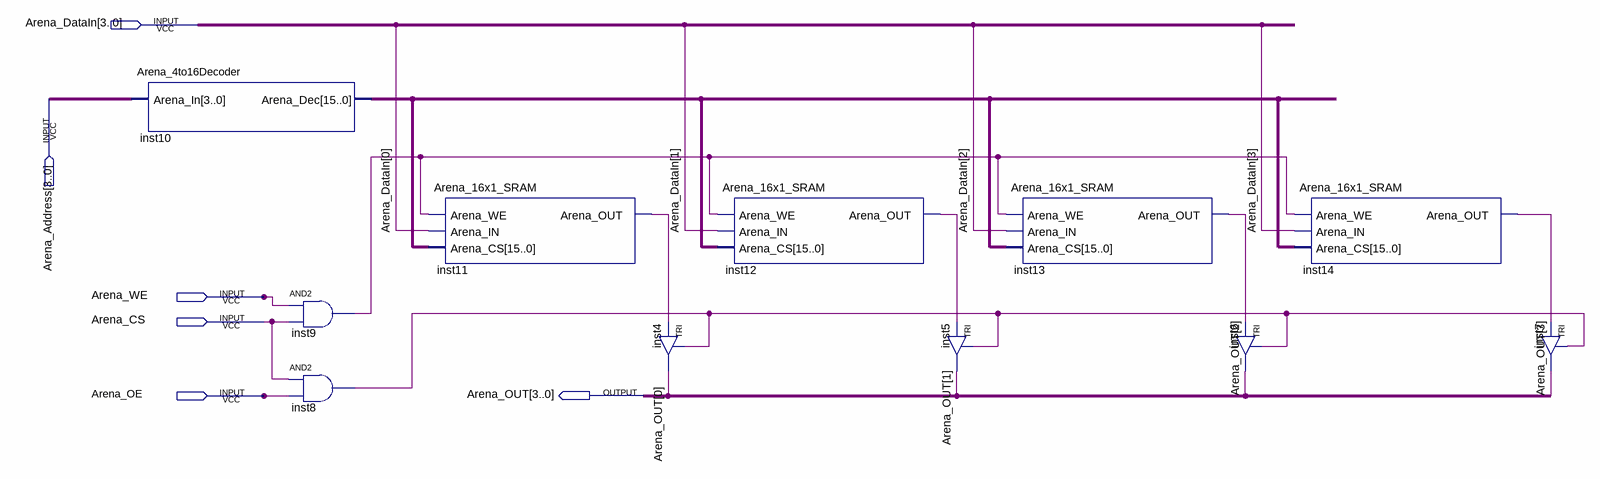
[diagram p0: schematic sheet]
// Quartus schematic Arena_16x4_SRAM.bdf as structural Verilog: 11 symbols, 6 pins
module Arena_16x4_SRAM (
  input  [3:0] Arena_DataIn,
  input  [3:0] Arena_Address,
  input  Arena_WE,
  input  Arena_CS,
  input  Arena_OE,
  output [3:0] Arena_OUT
);

  wire inst8_out, inst9_out, inst11_arena_out, inst12_arena_out, inst13_arena_out, inst14_arena_out;
  wire [15:0] inst10_arena_dec;

  Arena_4to16Decoder inst10 (.Arena_In(Arena_Address), .Arena_Dec(inst10_arena_dec));
  and inst9 (inst9_out, Arena_WE, Arena_CS);
  and inst8 (inst8_out, Arena_CS, Arena_OE);
  Arena_16x1_SRAM inst11 (
    .Arena_WE(inst9_out), .Arena_IN(Arena_DataIn[0]), .Arena_CS(inst10_arena_dec),
    .Arena_OUT(inst11_arena_out));
  TRI inst4 (.IN(inst11_arena_out), .OE(inst8_out), .OUT(Arena_OUT[0]));
  Arena_16x1_SRAM inst12 (
    .Arena_WE(inst9_out), .Arena_IN(Arena_DataIn[1]), .Arena_CS(inst10_arena_dec),
    .Arena_OUT(inst12_arena_out));
  TRI inst5 (.IN(inst12_arena_out), .OE(inst8_out), .OUT(Arena_OUT[1]));
  Arena_16x1_SRAM inst13 (
    .Arena_WE(inst9_out), .Arena_IN(Arena_DataIn[2]), .Arena_CS(inst10_arena_dec),
    .Arena_OUT(inst13_arena_out));
  TRI inst6 (.IN(inst13_arena_out), .OE(inst8_out), .OUT(Arena_OUT[2]));
  Arena_16x1_SRAM inst14 (
    .Arena_WE(inst9_out), .Arena_IN(Arena_DataIn[3]), .Arena_CS(inst10_arena_dec),
    .Arena_OUT(inst14_arena_out));
  TRI inst7 (.IN(inst14_arena_out), .OE(inst8_out), .OUT(Arena_OUT[3]));
endmodule
